# Altium project BRG_Chip_Tester.PrjPcb
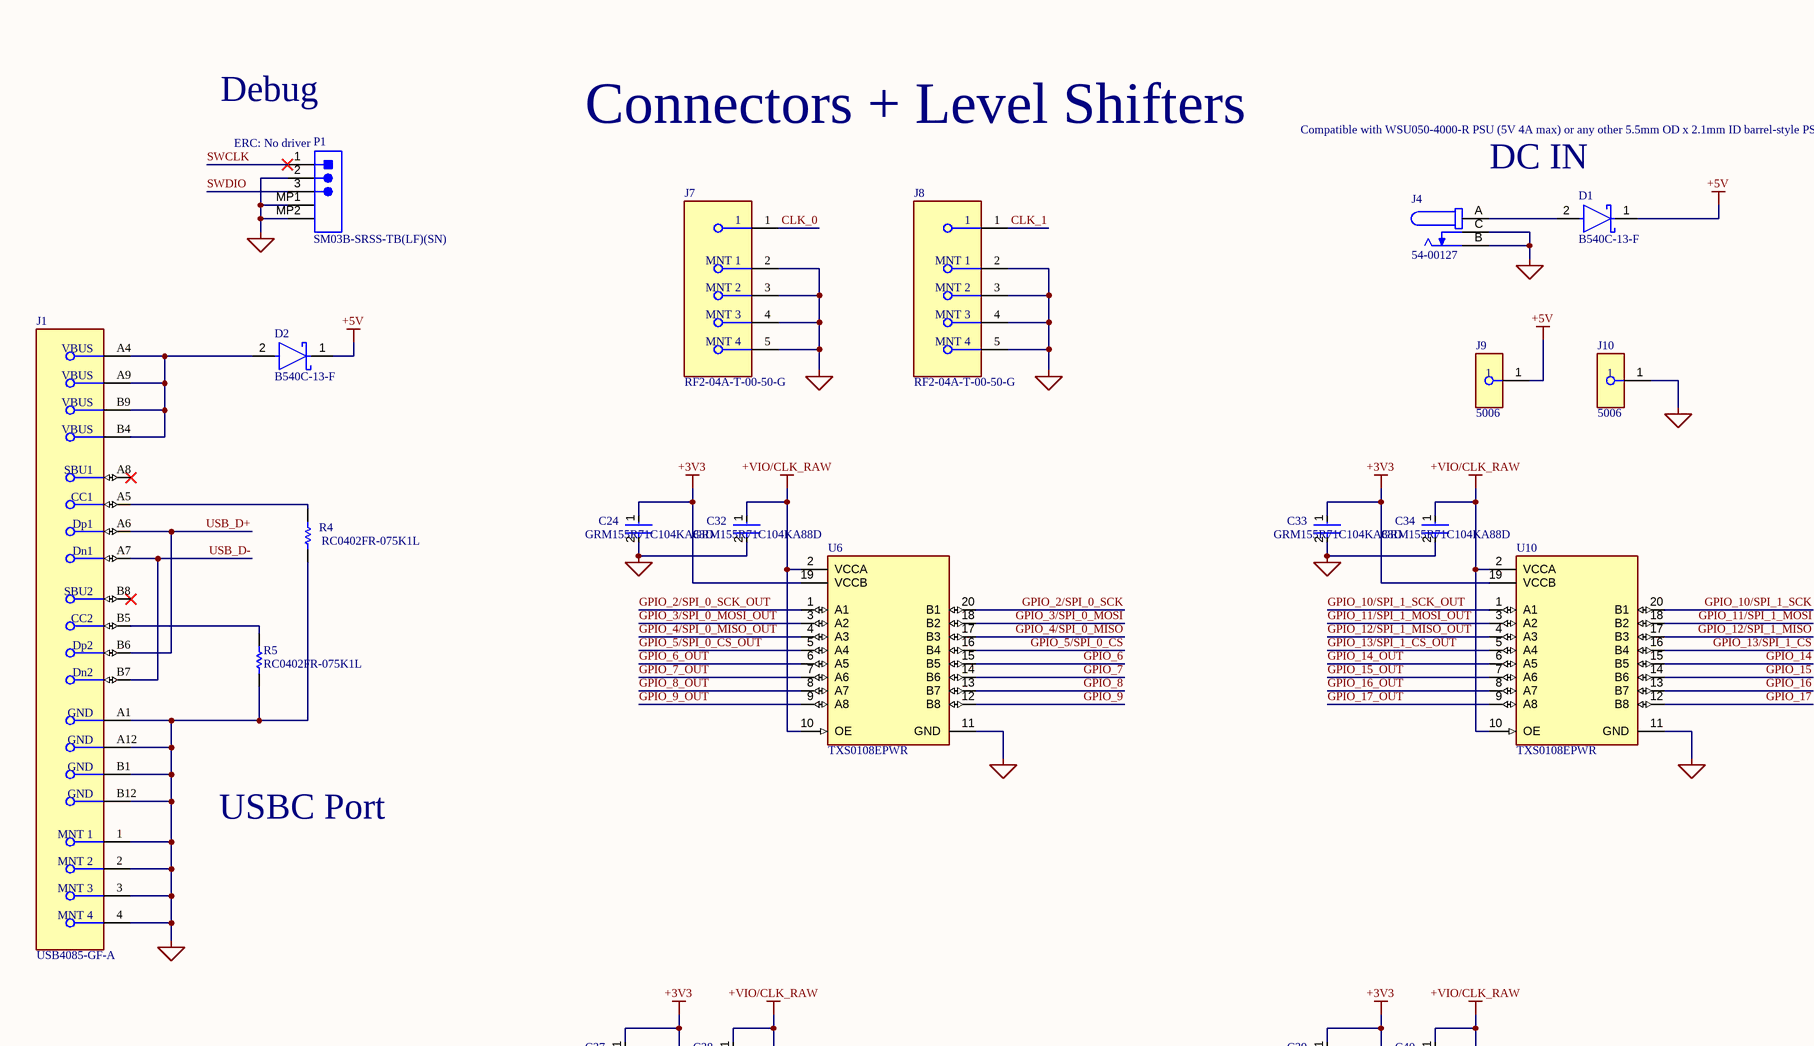
[diagram p0: BRG_Chip_Tester.SchDoc, top left]
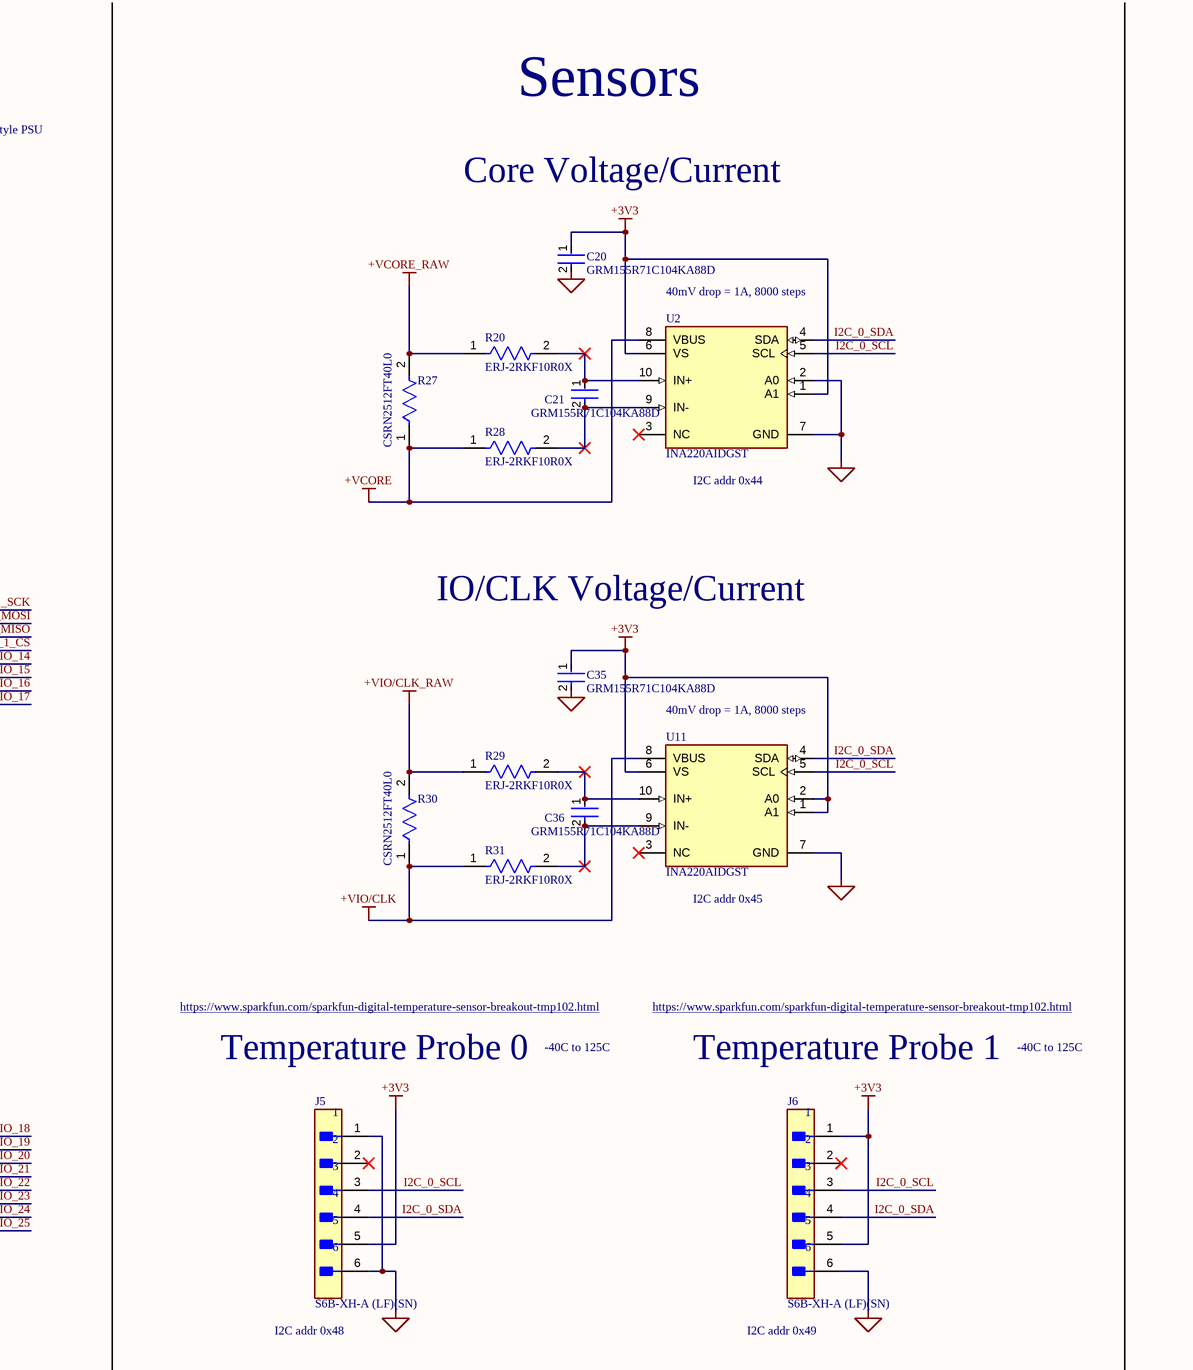
[diagram p1: BRG_Chip_Tester.SchDoc, top middle]
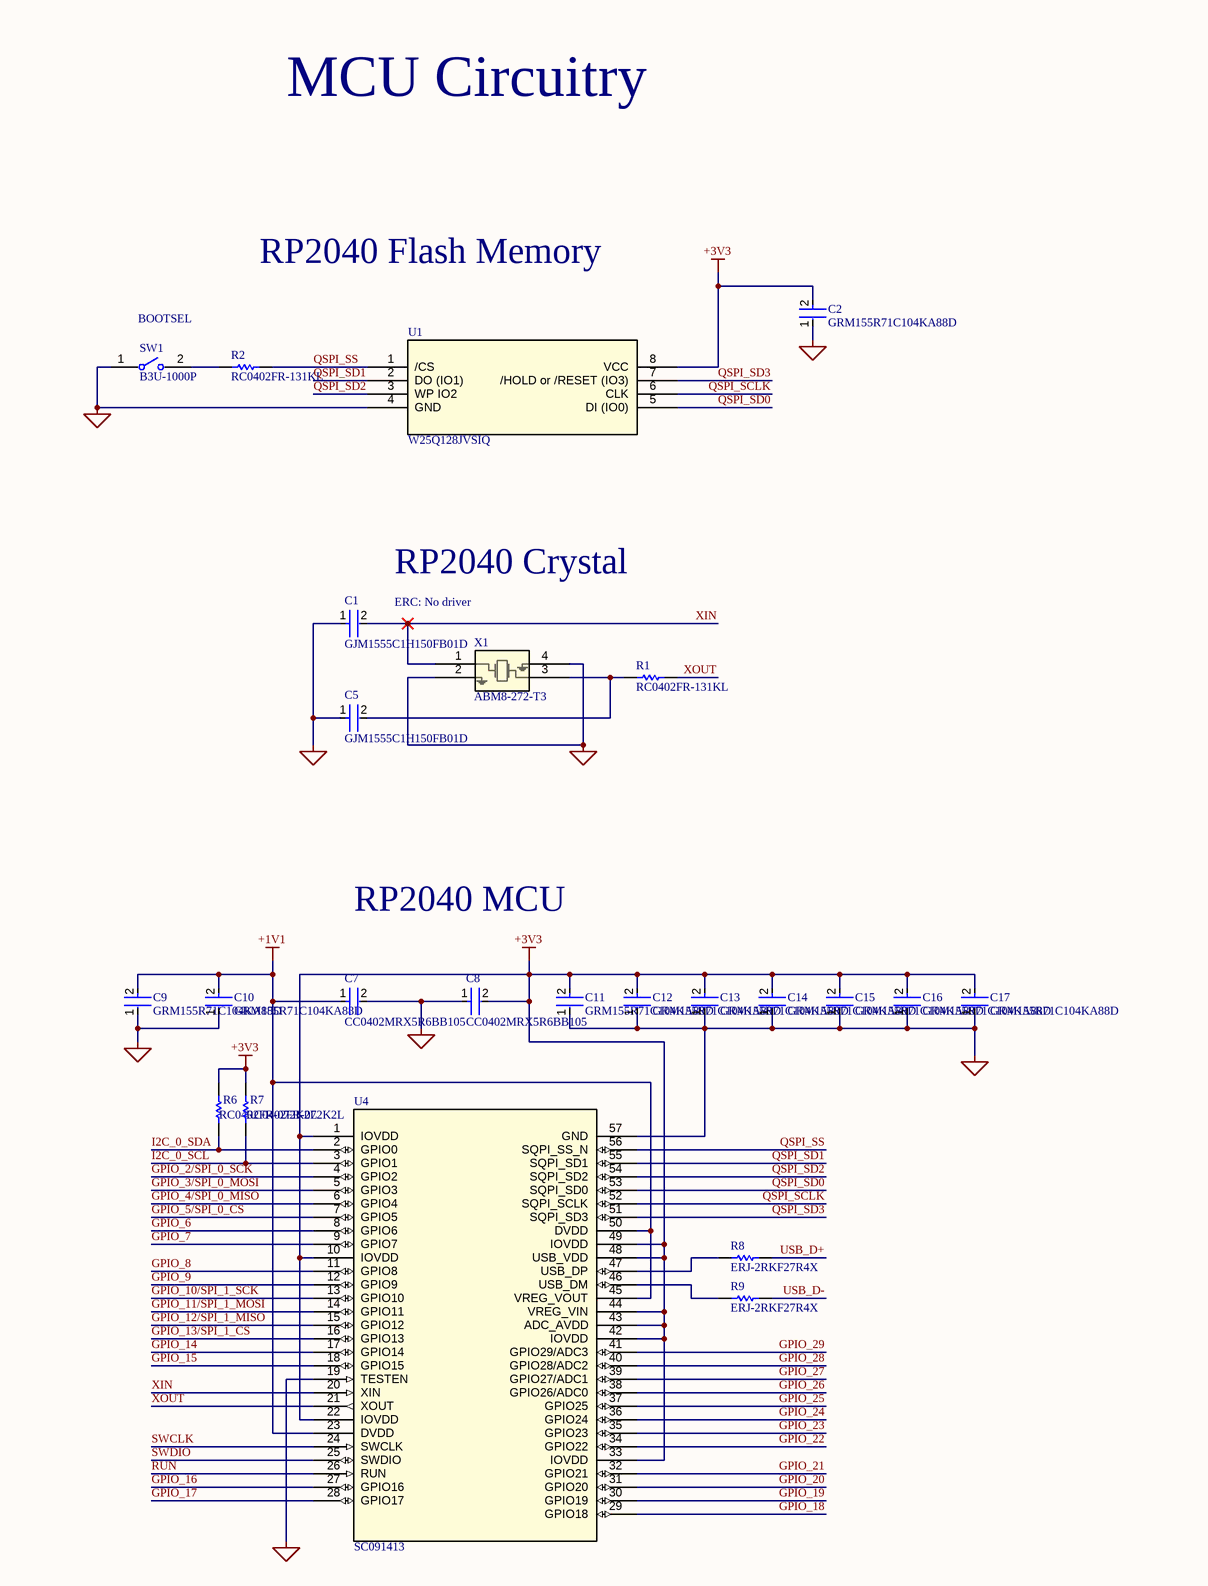
[diagram p2: BRG_Chip_Tester.SchDoc, top right]
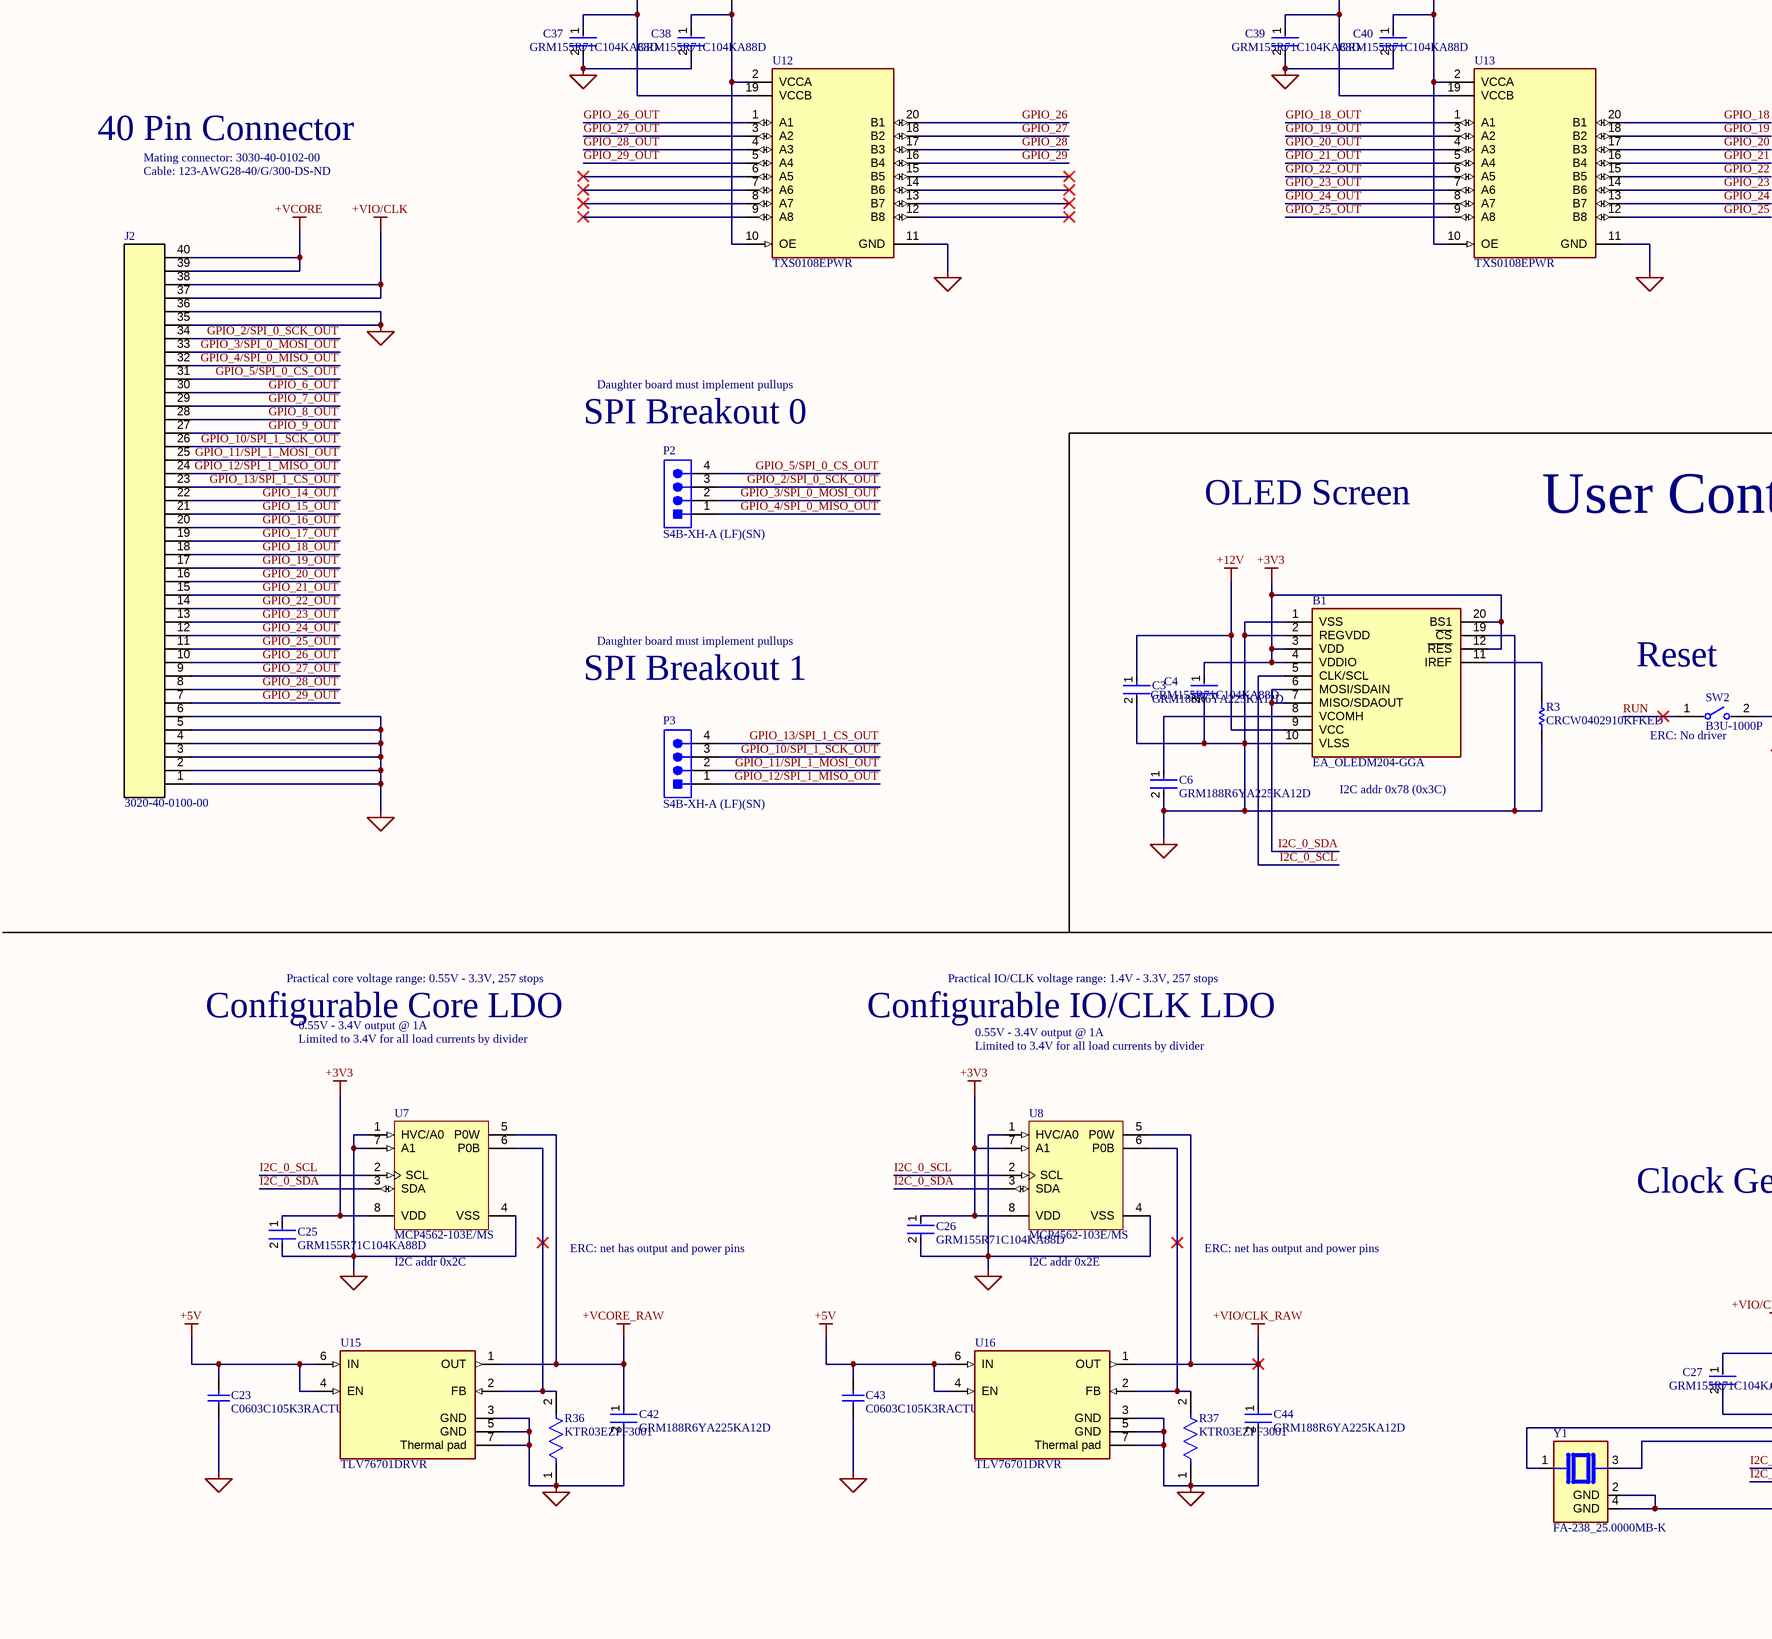
[diagram p3: BRG_Chip_Tester.SchDoc, bottom left]
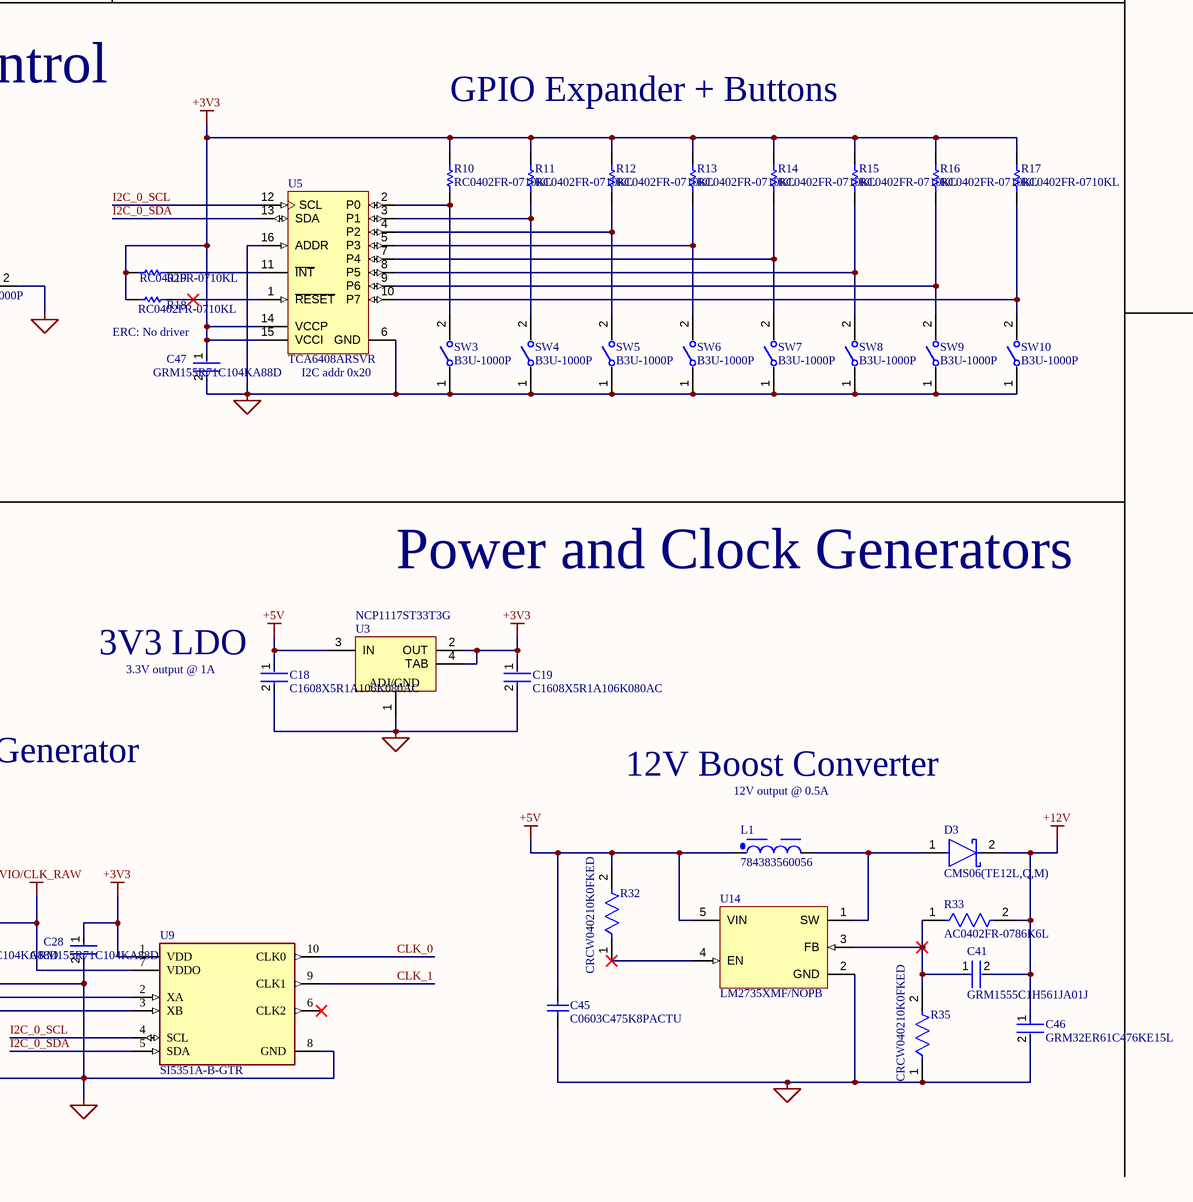
[diagram p4: BRG_Chip_Tester.SchDoc, bottom middle]
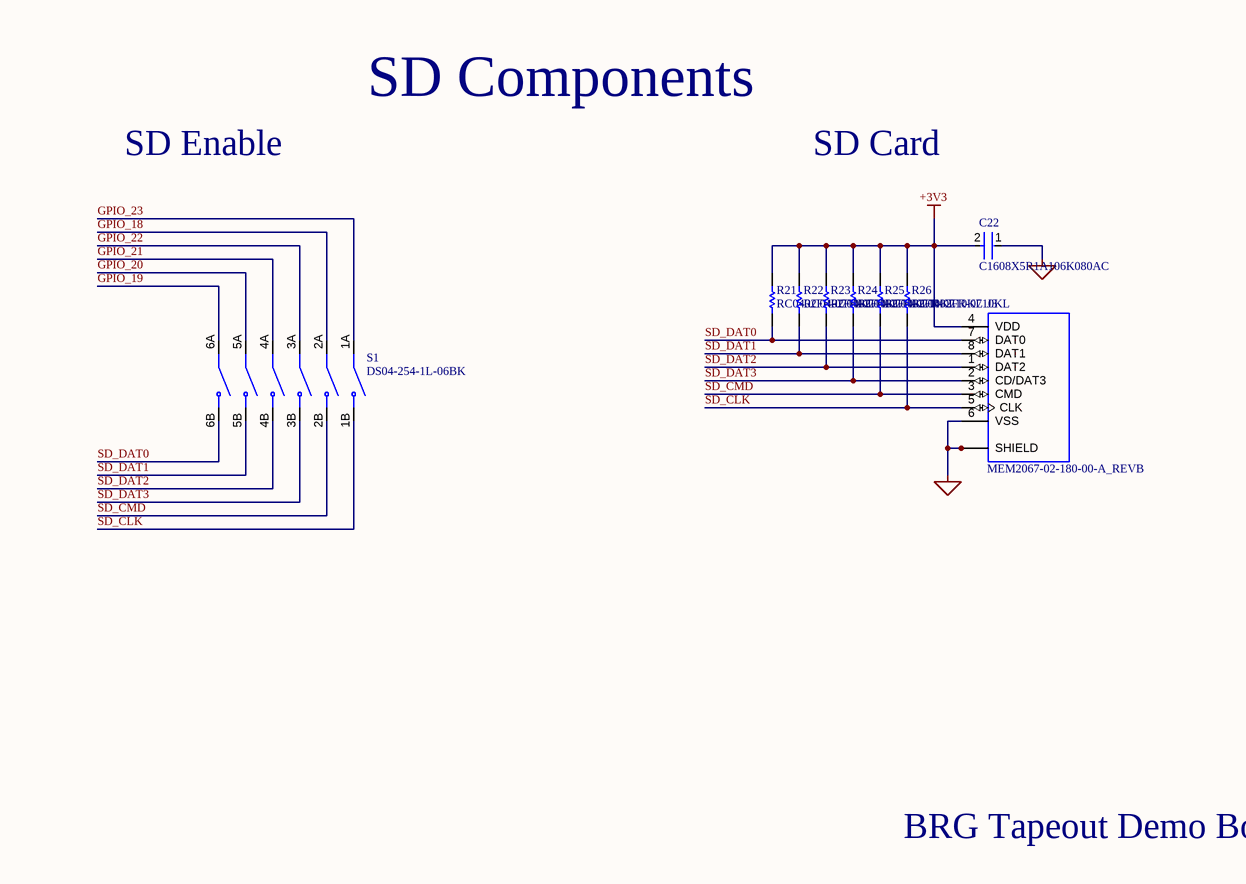
[diagram p5: BRG_Chip_Tester.SchDoc, bottom right]
1 sheet, 127 parts. Net scope: global (net labels, ports and power ports of the same name join across sheets).
Board file: BRG_Chip_Tester.PcbDoc

## Sheet BRG_Chip_Tester.SchDoc
size 863 x 558 mm; SheetNumber: 1; SheetTotal: 1

### Parts
B1  EA_OLEDM204-GGA  [EAOLEDM204GGA]
C1  GJM1555C1H150FB01D  [FP-GJM155-0_05-MFG]
C2  GRM155R71C104KA88D  [FP-GRM15-MFG]
C3  GRM188R6YA225KA12D  [FP-GRM188-0_1-e0_2_0_5-IPC_C]
C4  GRM155R71C104KA88D  [FP-GRM15-MFG]
C5  GJM1555C1H150FB01D  [FP-GJM155-0_05-MFG]
C6  GRM188R6YA225KA12D  [FP-GRM188-0_1-e0_2_0_5-IPC_C]
C7  CC0402MRX5R6BB105  [FP-CC0402-MFG]
C8  CC0402MRX5R6BB105  [FP-CC0402-MFG]
C9  GRM155R71C104KA88D  [FP-GRM15-MFG]
C10  GRM155R71C104KA88D  [FP-GRM15-MFG]
C11  GRM155R71C104KA88D  [FP-GRM15-MFG]
C12  GRM155R71C104KA88D  [FP-GRM15-MFG]
C13  GRM155R71C104KA88D  [FP-GRM15-MFG]
C14  GRM155R71C104KA88D  [FP-GRM15-MFG]
C15  GRM155R71C104KA88D  [FP-GRM15-MFG]
C16  GRM155R71C104KA88D  [FP-GRM15-MFG]
C17  GRM155R71C104KA88D  [FP-GRM15-MFG]
C18  C1608X5R1A106K080AC  [FP-C1608-080-0_1-MFG]
C19  C1608X5R1A106K080AC  [FP-C1608-080-0_1-MFG]
C20  GRM155R71C104KA88D  [FP-GRM15-MFG]
C21  GRM155R71C104KA88D  [FP-GRM15-MFG]
C22  C1608X5R1A106K080AC  [FP-C1608-080-0_1-MFG]
C23  C0603C105K3RACTU  [CAPC1608X87X35LL15T15]
C24  GRM155R71C104KA88D  [FP-GRM15-MFG]
C25  GRM155R71C104KA88D  [FP-GRM15-MFG]
C26  GRM155R71C104KA88D  [FP-GRM15-MFG]
C27  GRM155R71C104KA88D  [FP-GRM15-MFG]
C28  GRM155R71C104KA88D  [FP-GRM15-MFG]
C32  GRM155R71C104KA88D  [FP-GRM15-MFG]
C33  GRM155R71C104KA88D  [FP-GRM15-MFG]
C34  GRM155R71C104KA88D  [FP-GRM15-MFG]
C35  GRM155R71C104KA88D  [FP-GRM15-MFG]
C36  GRM155R71C104KA88D  [FP-GRM15-MFG]
C37  GRM155R71C104KA88D  [FP-GRM15-MFG]
C38  GRM155R71C104KA88D  [FP-GRM15-MFG]
C39  GRM155R71C104KA88D  [FP-GRM15-MFG]
C40  GRM155R71C104KA88D  [FP-GRM15-MFG]
C41  GRM1555C1H561JA01J  [FP-GRM155-0_05-IPC_A]
C42  GRM188R6YA225KA12D  [FP-GRM188-0_1-e0_2_0_5-IPC_C]
C43  C0603C105K3RACTU  [CAPC1608X87X35LL15T15]
C44  GRM188R6YA225KA12D  [FP-GRM188-0_1-e0_2_0_5-IPC_C]
C45  C0603C475K8PACTU  [CAPC1608X87X35NL15T15]
C46  GRM32ER61C476KE15L  [FP-GRM32E-0_3-0_2-IPC_C]
C47  GRM155R71C104KA88D  [FP-GRM15-MFG]
D1  B540C-13-F  [FP-SMC-MFG]
D2  B540C-13-F  [FP-SMC-MFG]
D3  CMS06(TE12L,Q,M)  [FP-M-FLAT-MFG]
J1  USB4085-GF-A  [FP-USB4085-GF-A-MFG]
J2  3020-40-0100-00  [CONN_3020-40-0100-00_CNC]
J3  MEM2067-02-180-00-A_REVB  [GCT_MEM2067-02-180-00-A_REVB]
J4  54-00127  [TENSILITY_54-00127]
J5  S6B-XH-A (LF)(SN)  [FP-S6B-XH-A_LF_SN-MFG]
J6  S6B-XH-A (LF)(SN)  [FP-S6B-XH-A_LF_SN-MFG]
J7  RF2-04A-T-00-50-G  [FP-RF2-04A-T-00-50-G-MFG]
J8  RF2-04A-T-00-50-G  [FP-RF2-04A-T-00-50-G-MFG]
J9  5006  [FP-5006-MFG]
J10  5006  [FP-5006-MFG]
L1  784383560056  [WE-MAIA_4020]
P1  SM03B-SRSS-TB(LF)(SN)  [JST-SM03B-SRSS-TB_V]
P2  S4B-XH-A (LF)(SN)  [JST-S4B-XH-A(LF)(SN)_V]
P3  S4B-XH-A (LF)(SN)  [JST-S4B-XH-A(LF)(SN)_V]
R1  RC0402FR-131KL  [RESC1005X40X25LL05T10]
R2  RC0402FR-131KL  [RESC1005X40X25LL05T10]
R3  CRCW0402910KFKED  [RESC1005X40X25LL05T05]
R4  RC0402FR-075K1L  [RESC1005X40X25NL05T10]
R5  RC0402FR-075K1L  [RESC1005X40X25NL05T10]
R6  RC0402FR-072K2L  [RESC1005X40X25NL05T10]
R7  RC0402FR-072K2L  [RESC1005X40X25NL05T10]
R8  ERJ-2RKF27R4X  [RESC1005X40X25ML05T05]
R9  ERJ-2RKF27R4X  [RESC1005X40X25ML05T05]
R10  RC0402FR-0710KL  [RESC1005X40X25LL05T10]
R11  RC0402FR-0710KL  [RESC1005X40X25LL05T10]
R12  RC0402FR-0710KL  [RESC1005X40X25LL05T10]
R13  RC0402FR-0710KL  [RESC1005X40X25LL05T10]
R14  RC0402FR-0710KL  [RESC1005X40X25LL05T10]
R15  RC0402FR-0710KL  [RESC1005X40X25LL05T10]
R16  RC0402FR-0710KL  [RESC1005X40X25LL05T10]
R17  RC0402FR-0710KL  [RESC1005X40X25LL05T10]
R18  RC0402FR-0710KL  [RESC1005X40X25LL05T10]
R19  RC0402FR-0710KL  [RESC1005X40X25LL05T10]
R20  ERJ-2RKF10R0X  [FP-ERJ2RK-MFG]
R21  RC0402FR-0710KL  [RESC1005X40X25LL05T10]
R22  RC0402FR-0710KL  [RESC1005X40X25LL05T10]
R23  RC0402FR-0710KL  [RESC1005X40X25LL05T10]
R24  RC0402FR-0710KL  [RESC1005X40X25LL05T10]
R25  RC0402FR-0710KL  [RESC1005X40X25LL05T10]
R26  RC0402FR-0710KL  [RESC1005X40X25LL05T10]
R27  CSRN2512FT40L0  [FP-CSRN2512-IPC_C]
R28  ERJ-2RKF10R0X  [FP-ERJ2RK-MFG]
R29  ERJ-2RKF10R0X  [FP-ERJ2RK-MFG]
R30  CSRN2512FT40L0  [FP-CSRN2512-IPC_C]
R31  ERJ-2RKF10R0X  [FP-ERJ2RK-MFG]
R32  CRCW040210K0FKED  [FP-CRCW0402-e3-IPC_B]
R33  AC0402FR-0786K6L  [FP-AC0402-IPC_B]
R35  CRCW040210K0FKED  [FP-CRCW0402-e3-IPC_B]
R36  KTR03EZPF3001  [FP-KTR03-MFG]
R37  KTR03EZPF3001  [FP-KTR03-MFG]
S1  DS04-254-1L-06BK  [SW_DS04-254-1L-06BK]
SW1  B3U-1000P  [FP-B3U-1000P-MFG]
SW2  B3U-1000P  [FP-B3U-1000P-MFG]
SW3  B3U-1000P  [FP-B3U-1000P-MFG]
SW4  B3U-1000P  [FP-B3U-1000P-MFG]
SW5  B3U-1000P  [FP-B3U-1000P-MFG]
SW6  B3U-1000P  [FP-B3U-1000P-MFG]
SW7  B3U-1000P  [FP-B3U-1000P-MFG]
SW8  B3U-1000P  [FP-B3U-1000P-MFG]
SW9  B3U-1000P  [FP-B3U-1000P-MFG]
SW10  B3U-1000P  [FP-B3U-1000P-MFG]
U1  W25Q128JVSIQ  [SOIC_128JVSIQ_WIN]
U2  INA220AIDGST  [FP-DGS0010A-MFG]
U3  NCP1117ST33T3G  [ONSC-SOT-223-4-318H-01_A_V]
U4  SC091413  [QFN56_7X7_RPI]
U5  TCA6408ARSVR  [RSV0016A_V]
U6  TXS0108EPWR  [FP-PW0020A-IPC_C]
U7  MCP4562-103E/MS  [MSOP-MS8_M]
U8  MCP4562-103E/MS  [MSOP-MS8_M]
U9  SI5351A-B-GTR  [FP-SI5351A-B-GTR-MFG]
U10  TXS0108EPWR  [FP-PW0020A-IPC_C]
U11  INA220AIDGST  [FP-DGS0010A-MFG]
U12  TXS0108EPWR  [FP-PW0020A-IPC_C]
U13  TXS0108EPWR  [FP-PW0020A-IPC_C]
U14  LM2735XMF/NOPB  [DBV0005A_N]
U15  TLV76701DRVR  [FP-DRV0006A-IPC_C]
U16  TLV76701DRVR  [FP-DRV0006A-IPC_C]
X1  ABM8-272-T3  [ABM8-272-T3_ABR]
Y1  FA-238_25.0000MB-K  [XTAL_FA-238_25.0000MB-K]

### Nets
+1V1: C7.1 C9.2 C10.2 U4.23(DVDD) U4.45(VREG_VOUT) U4.50(DVDD)
+3V3: B1.3(VDD) B1.4(VDDIO) B1.12(~{RES}) B1.20(BS1) C2.2 C4.1 C8.2 C11.2 C12.2 C13.2 C14.2 C15.2 C16.2 C17.2 C19.1 C20.1 C22.2 C24.1 C25.1 C26.1 C28.1 C33.1 C35.1 C37.1 C39.1 C47.1 J3.4(VDD) J5.5 J6.1 J6.5 R6.2 R7.2 R10.2 R11.2 R12.2 R13.2 R14.2 R15.2 R16.2 R17.2 R18.1 R19.2 R21.2 R22.2 R23.2 R24.2 R25.2 R26.2 U1.8(VCC) U2.1(A1) U2.6(VS) U3.2(OUT) U3.4(TAB) U4.1(IOVDD) U4.10(IOVDD) U4.22(IOVDD) U4.33(IOVDD) U4.42(IOVDD) U4.43(ADC_AVDD) U4.44(VREG_VIN) U4.48(USB_VDD) U4.49(IOVDD) U5.14(VCCP) U5.15(VCCI) U6.19(VCCB) U7.8(VDD) U8.7(A1) U8.8(VDD) U9.1(VDD) U10.19(VCCB) U11.1(A1) U11.2(A0) U11.6(VS) U12.19(VCCB) U13.19(VCCB)
+5V: C18.1 C23.2 C43.2 C45.2 D1.1(C) D2.1(C) J9.1 L1.1 R32.2 U3.3(IN) U14.5(VIN) U15.4(EN) U15.6(IN) U16.4(EN) U16.6(IN)
+12V: B1.9(VCC) C3.1 C41.2 C46.1 D3.2(C) R33.2
+VCORE: J2.39 J2.40 R27.1 R28.1 U2.8(VBUS)
+VCORE_RAW: C42.1 R20.1 R27.2 U7.5(P0W) U15.1(OUT)
+VIO/CLK: J2.37 J2.38 R30.1 R31.1 U11.8(VBUS)
+VIO/CLK_RAW: C27.1 C32.1 C34.1 C38.1 C40.1 C44.1 R29.1 R30.2 U6.2(VCCA) U6.10(OE) U8.5(P0W) U9.7(VDDO) U10.2(VCCA) U10.10(OE) U12.2(VCCA) U12.10(OE) U13.2(VCCA) U13.10(OE) U16.1(OUT)
GND: B1.1(VSS) B1.2(REGVDD) B1.10(VLSS) B1.19(~{CS}) C1.1 C2.1 C3.2 C4.2 C5.1 C6.2 C7.2 C8.1 C9.1 C10.1 C11.1 C12.1 C13.1 C14.1 C15.1 C16.1 C17.1 C18.2 C19.2 C20.2 C22.1 C23.1 C24.2 C25.2 C26.2 C27.2 C28.2 C32.2 C33.2 C34.2 C35.2 C37.2 C38.2 C39.2 C40.2 C42.2 C43.1 C44.2 C45.1 C46.2 C47.2 J1.1(MNT_1) J1.2(MNT_2) J1.3(MNT_3) J1.4(MNT_4) J1.A1(GND) J1.A12(GND) J1.B1(GND) J1.B12(GND) J2.1 J2.2 J2.3 J2.4 J2.5 J2.6 J2.35 J2.36 J3.6(VSS) J3.9(SHIELD) J3.10(SHIELD) J3.11(SHIELD) J3.12(SHIELD) J4.B J4.C J5.1 J5.6 J6.6 J7.2(MNT_1) J7.3(MNT_2) J7.4(MNT_3) J7.5(MNT_4) J8.2(MNT_1) J8.3(MNT_2) J8.4(MNT_3) J8.5(MNT_4) J10.1 P1.2 P1.MP1 P1.MP2 R3.1 R4.1 R5.1 R35.1 R36.1 R37.1 SW1.1 SW2.2 SW3.1 SW4.1 SW5.1 SW6.1 SW7.1 SW8.1 SW9.1 SW10.1 U1.4(GND) U2.2(A0) U2.7(GND) U3.1(ADJ/GND) U4.19(TESTEN) U4.57(GND) U5.6(GND) U5.16(ADDR) U6.11(GND) U7.1(HVC/A0) U7.4(VSS) U7.7(A1) U8.1(HVC/A0) U8.4(VSS) U9.8(GND) U10.11(GND) U11.7(GND) U12.11(GND) U13.11(GND) U14.2(GND) U15.3(GND) U15.5(GND) U15.7(Thermal_pad) U16.3(GND) U16.5(GND) U16.7(Thermal_pad) X1.2 X1.4 Y1.2(GND) Y1.4(GND)
CLK_0: J7.1 U9.10(CLK0)
CLK_1: J8.1 U9.9(CLK1)
GPIO_2/SPI_0_SCK: U4.4(GPIO2) U6.20(B1)
GPIO_2/SPI_0_SCK_OUT: J2.34 P2.3 U6.1(A1)
GPIO_3/SPI_0_MOSI: U4.5(GPIO3) U6.18(B2)
GPIO_3/SPI_0_MOSI_OUT: J2.33 P2.2 U6.3(A2)
GPIO_4/SPI_0_MISO: U4.6(GPIO4) U6.17(B3)
GPIO_4/SPI_0_MISO_OUT: J2.32 P2.1 U6.4(A3)
GPIO_5/SPI_0_CS: U4.7(GPIO5) U6.16(B4)
GPIO_5/SPI_0_CS_OUT: J2.31 P2.4 U6.5(A4)
GPIO_6: U4.8(GPIO6) U6.15(B5)
GPIO_6_OUT: J2.30 U6.6(A5)
GPIO_7: U4.9(GPIO7) U6.14(B6)
GPIO_7_OUT: J2.29 U6.7(A6)
GPIO_8: U4.11(GPIO8) U6.13(B7)
GPIO_8_OUT: J2.28 U6.8(A7)
GPIO_9: U4.12(GPIO9) U6.12(B8)
GPIO_9_OUT: J2.27 U6.9(A8)
GPIO_10/SPI_1_SCK: U4.13(GPIO10) U10.20(B1)
GPIO_10/SPI_1_SCK_OUT: J2.26 P3.3 U10.1(A1)
GPIO_11/SPI_1_MOSI: U4.14(GPIO11) U10.18(B2)
GPIO_11/SPI_1_MOSI_OUT: J2.25 P3.2 U10.3(A2)
GPIO_12/SPI_1_MISO: U4.15(GPIO12) U10.17(B3)
GPIO_12/SPI_1_MISO_OUT: J2.24 P3.1 U10.4(A3)
GPIO_13/SPI_1_CS: U4.16(GPIO13) U10.16(B4)
GPIO_13/SPI_1_CS_OUT: J2.23 P3.4 U10.5(A4)
GPIO_14: U4.17(GPIO14) U10.15(B5)
GPIO_14_OUT: J2.22 U10.6(A5)
GPIO_15: U4.18(GPIO15) U10.14(B6)
GPIO_15_OUT: J2.21 U10.7(A6)
GPIO_16: U4.27(GPIO16) U10.13(B7)
GPIO_16_OUT: J2.20 U10.8(A7)
GPIO_17: U4.28(GPIO17) U10.12(B8)
GPIO_17_OUT: J2.19 U10.9(A8)
GPIO_18: S1.2A(COM2) U4.29(GPIO18) U13.20(B1)
GPIO_18_OUT: J2.18 U13.1(A1)
GPIO_19: S1.6A(COM6) U4.30(GPIO19) U13.18(B2)
GPIO_19_OUT: J2.17 U13.3(A2)
GPIO_20: S1.5A(COM5) U4.31(GPIO20) U13.17(B3)
GPIO_20_OUT: J2.16 U13.4(A3)
GPIO_21: S1.4A(COM4) U4.32(GPIO21) U13.16(B4)
GPIO_21_OUT: J2.15 U13.5(A4)
GPIO_22: S1.3A(COM3) U4.34(GPIO22) U13.15(B5)
GPIO_22_OUT: J2.14 U13.6(A5)
GPIO_23: S1.1A(COM1) U4.35(GPIO23) U13.14(B6)
GPIO_23_OUT: J2.13 U13.7(A6)
GPIO_24: U4.36(GPIO24) U13.13(B7)
GPIO_24_OUT: J2.12 U13.8(A7)
GPIO_25: U4.37(GPIO25) U13.12(B8)
GPIO_25_OUT: J2.11 U13.9(A8)
GPIO_26: U4.38(GPIO26/ADC0) U12.20(B1)
GPIO_26_OUT: J2.10 U12.1(A1)
GPIO_27: U4.39(GPIO27/ADC1) U12.18(B2)
GPIO_27_OUT: J2.9 U12.3(A2)
GPIO_28: U4.40(GPIO28/ADC2) U12.17(B3)
GPIO_28_OUT: J2.8 U12.4(A3)
GPIO_29: U4.41(GPIO29/ADC3) U12.16(B4)
GPIO_29_OUT: J2.7 U12.5(A4)
I2C_0_SCL: B1.5(CLK/SCL) J5.3 J6.3 R7.1 U2.5(SCL) U4.3(GPIO1) U5.12(SCL) U7.2(SCL) U8.2(SCL) U9.4(SCL) U11.5(SCL)
I2C_0_SDA: B1.6(MOSI/SDAIN) B1.7(MISO/SDAOUT) J5.4 J6.4 R6.1 U2.4(SDA) U4.2(GPIO0) U5.13(SDA) U7.3(SDA) U8.3(SDA) U9.5(SDA) U11.4(SDA)
QSPI_SCLK: U1.6(CLK) U4.52(SQPI_SCLK)
QSPI_SD0: U1.5(DI_(IO0)) U4.53(SQPI_SD0)
QSPI_SD1: U1.2(DO_(IO1)) U4.55(SQPI_SD1)
QSPI_SD2: U1.3(WP_IO2) U4.54(SQPI_SD2)
QSPI_SD3: U1.7(/HOLD_or_/RESET_(IO3)) U4.51(SQPI_SD3)
QSPI_SS: R2.2 U1.1(/CS) U4.56(SQPI_SS_N)
RUN: SW2.1 U4.26(RUN)
SD_CLK: J3.5(CLK) R26.1 S1.1B(NO1)
SD_CMD: J3.3(CMD) R25.1 S1.2B(NO2)
SD_DAT0: J3.7(DAT0) R21.1 S1.6B(NO6)
SD_DAT1: J3.8(DAT1) R22.1 S1.5B(NO5)
SD_DAT2: J3.1(DAT2) R23.1 S1.4B(NO4)
SD_DAT3: J3.2(CD/DAT3) R24.1 S1.3B(NO3)
SWCLK: P1.1 U4.24(SWCLK)
SWDIO: P1.3 U4.25(SWDIO)
USB_D+: J1.A6(Dp1) J1.B6(Dp2) R8.2
USB_D-: J1.A7(Dn1) J1.B7(Dn2) R9.2
XIN: C1.2 U4.20(XIN) X1.1
XOUT: R1.2 U4.21(XOUT)
NetB1_8: B1.8(VCOMH) C6.1
NetB1_11: B1.11(IREF) R3.2
NetC5_2: C5.2 R1.1 X1.3
NetC21_1: C21.1 R20.2 U2.10(IN+)
NetC21_2: C21.2 R28.2 U2.9(IN-)
NetC36_1: C36.1 R29.2 U11.10(IN+)
NetC36_2: C36.2 R31.2 U11.9(IN-)
NetC41_1: C41.1 R33.1 R35.2 U14.3(FB)
NetD1_2: D1.2(A) J4.A
NetD2_2: D2.2(A) J1.A4(VBUS) J1.A9(VBUS) J1.B4(VBUS) J1.B9(VBUS)
NetD3_1: D3.1(A) L1.2 U14.1(SW)
NetJ1_A5: J1.A5(CC1) R4.2
NetJ1_B5: J1.B5(CC2) R5.2
NetR2_1: R2.1 SW1.2
NetR8_1: R8.1 U4.47(USB_DP)
NetR9_1: R9.1 U4.46(USB_DM)
NetR10_1: R10.1 SW3.2 U5.2(P0)
NetR11_1: R11.1 SW4.2 U5.3(P1)
NetR12_1: R12.1 SW5.2 U5.4(P2)
NetR13_1: R13.1 SW6.2 U5.5(P3)
NetR14_1: R14.1 SW7.2 U5.7(P4)
NetR15_1: R15.1 SW8.2 U5.8(P5)
NetR16_1: R16.1 SW9.2 U5.9(P6)
NetR17_1: R17.1 SW10.2 U5.10(P7)
NetR18_2: R18.2 U5.1(~{RESET})
NetR19_1: R19.1 U5.11(~{INT})
NetR32_1: R32.1 U14.4(EN)
NetR36_2: R36.2 U7.6(P0B) U15.2(FB)
NetR37_2: R37.2 U8.6(P0B) U16.2(FB)
NetU9_2: U9.2(XA) Y1.1
NetU9_3: U9.3(XB) Y1.3

Not connected (* = marked no-connect by the designer): J1 A8(SBU1)* B8(SBU2)*; J5 2*; J6 2*; U2 3(NC)*; U9 6(CLK2)*; U11 3(NC)*; U12 6(A5)* 7(A6)* 8(A7)* 9(A8)* 12(B8)* 13(B7)* 14(B6)* 15(B5)*

### Notes on the sheet
- Debug
- (near P1) ERC: No driver
- Connectors + Level Shifters
- Compatible with WSU050-4000-R PSU (5V 4A max) or any other 5.5mm OD x 2.1mm ID barrel-style PSU
- Sensors
- DC IN
- Core Voltage/Current
- MCU Circuitry
- (near U2) 40mV drop = 1A, 8000 steps
- RP2040 Flash Memory
- (near SW1) BOOTSEL
- (near U2) I2C addr 0x44
- IO/CLK Voltage/Current
- RP2040 Crystal
- ERC: No driver
- (near U11) 40mV drop = 1A, 8000 steps
- USBC Port
- (near U11) I2C addr 0x45
- https://www.sparkfun.com/sparkfun-digital-temperature-sensor-breakout-tmp102.html
- RP2040 MCU
- Temperature Probe 0
- -40C to 125C
- Temperature Probe 1
- 40 Pin Connector
- Mating connector: 3030-40-0102-00
- Cable: 123-AWG28-40/G/300-DS-ND
- I2C addr 0x48
- I2C addr 0x49
- Daughter board must implement pullups
- (near P2) SPI Breakout 0
- OLED Screen
- User Control
- GPIO Expander + Buttons
- SPI Breakout 1
- (near SW2) Reset
- (near SW2) ERC: No driver
- (near B1) I2C addr 0x78 (0x3C)
- (near U5) I2C addr 0x20
- SD Components
- SD Enable
- SD Card
- Configurable Core LDO
- Practical core voltage range: 0.55V - 3.3V, 257 stops
- Configurable IO/CLK LDO
- Practical IO/CLK voltage range: 1.4V - 3.3V, 257 stops
- Power and Clock Generators
- 0.55V - 3.4V output @ 1A
- Limited to 3.4V for all load currents by divider
- (near C18) 3V3 LDO
- (near C18) 3.3V output @ 1A
- Clock Generator
- 12V Boost Converter
- 12V output @ 0.5A
- (near U7) I2C addr 0x2C
- ERC: net has output and power pins
- (near U8) I2C addr 0x2E
- BRG Tapeout Demo Board
- DWG. NO.
- REV.
- SHT.
- REVISION
- DESCRIPTION
- DATE
- APPROVED
- THIS DOCUMENT AND THE DATA DISCLOSED HEREIN OR HEREWITH IS THE PROPERTY OF ALTIUM LIMITED AND MAY BE FREELY DISTRIBUTED IN WHOLE. NO RIGHTS ARE RESERVED OR EXPRESS OR IMPLIED WARANTEE GIVEN.
- ENG:
- DSN:
- APPROVALS
- PROJECT
- DOCUMENT REVISION:
- DESIGN ITEM:
- CHK:
- BOM:
- REFERENCE DOCUMENTS
- PROJECT REVISION:
- TITLE
- FAB DWG:
- PCB DWG:
- ASSY DWG:
- SCALE:
- SIZE
- D
- CAGE CODE
- FILE NAME
- DWG NO.
- SHEET
- OF
- REV

### Library data of the parts
B1 = EA_OLEDM204-GGA: OLED Displays & Accessories Charcter OLED Yellow 4x20 with glass; Manufacturer_Name: Display Visions; Manufacturer_Part_Number: EA OLEDM204-GGA; Geometry.Height: 2.4mm; Mouser Part Number: 790-EAOLEDM204GGA; Mouser Price/Stock: https://www.mouser.co.uk/ProductDetail/Display-Visions/EA-OLEDM204-GGA?qs=w%2Fv1CP2dgqpjPd2NeKBlNQ%3D%3D; Datasheet Link: https://www.lcd-module.de/fileadmin/html-seiten/eng/pdf/doma/oledm204-ae.pdf
C1 C5 = CMP-2008-03802-2: Multi-Layer Ceramic Capacitor 15pF C0G  ±1% 0402 Paper T/R; Voltage: 50V; Termination: SMD/SMT; Radiation Hardening: No; Depth: 0.5mm; Length: 1mm; Package Quantity: 10000; Tolerance: 1%; Dielectric: C0G; Capacitance: 15pF; Max Operating Temperature: 125°C; Thickness: 0.022inch; Case Code (Metric): 1005; Min Operating Temperature: -55°C; Case Code (Imperial): 0402; Case/Package: 0402; Voltage Rating (DC): 50V; Height: 0.5mm; Voltage Rating: 50V; Width: 0.02inch; Packaging: Tape and Reel; Mount: Surface Mount
C2 C4 C9-C17 C20 C21 C24-C28 C32-C40 C47 = CMP-2100-03641-2: CAP CER 0.1UF 16V X7R 0402; Standoff Height: 0mm; Tolerance: 10%; RoHS: TRUE; Manufacturer Part Number: GRM155R71C104KA88D; Temperature Characteristic: X7R; Octopart: https://octopart.com/grm155r71c104ka88d-murata-196880; Digikey Description: CAP CER 0.1UF 16V X7R 0402; Device Class L3: Ceramic Capacitors; Height: 0.55mm; ComponentLink2Description: Datasheet; Temperature Range Low: -55°C; Ipc Land Pattern Name: CAPC10050X219; ComponentLink2URL: https://search.murata.co.jp/Ceramy/image/img/A01X/G101/ENG/GRM155R71H471KA01-01A.pdf; Device Class L1: Passive Components; Lead Free: yes; Category: Cap
C3 C6 C42 C44 = CMP-2006-02548-2: Chip Multilayer Ceramic Capacitors for General Purpose, 0603, 2.2uF, X5R, 15%, 10%, 35V; REACH SVHC: No SVHC; Weight: 0.000222oz; Thickness: 0.035inch; Height: 0.8mm; Voltage Rating: 35V; Lead Free: Lead Free; Mount: Surface Mount; Material: Ceramic; Package Quantity: 4000; Capacitance: 2.2uF; Length: 1.6mm; Packaging: Tape and Reel; Case/Package: 0603; Min Operating Temperature: -55°C; Case Code (Metric): 1608; Voltage: 35V; Tolerance: 10%; Max Operating Temperature: 85°C; Depth: 0.8mm; Width: 0.8mm; Case Code (Imperial): 0603; Voltage Rating (DC): 35V; Termination: SMD/SMT; Dielectric: X5R
C7 C8 = CMP-1034-02117-2: CAP CER 1UF 10V X5R 0402; Manufacturer: YAGEO; Material: Ceramic; Tolerance: 0.2; Automotive Grade: NA; Temperature Coefficient: 30ppm/°C; Automotive: No; Category: Cap; ComponentLink2URL: http://www.yageo.com/documents/recent/UPY-GP_NP0_16V-to-50V_16.pdf; Value: 1 uF; Temperature Range High: +125°C; Footprint Url: http://www.yageo.com/exep/pages/download/literatures/UPY-C_GEN_24.pdf; Voltage Rating: 10 V; Height: 0.55mm; RoHS: TRUE; Device Class L2: Capacitors; Capacitance: 1 uF; Device Class L1: Passive Components; Device Class L3: Ceramic Capacitors; Temperature Characteristic: X5R; Temperature Range Low: -55°C; Mouser Description: Multilayer Ceramic Capacitors MLCC - SMD/SMT 1.0uF 10V X5R 20%; Octopart: https://octopart.com/cc0402mrx5r6bb105-yageo-9292740; ComponentLink2Description: Datasheet; Manufacturer Part Number: CC0402MRX5R6BB105; Temperature: -55°C to +125°C; Lead Free: Yes; Digikey Description: CAP CER 1UF 10V X5R 0402; Ipc Land Pattern Name: CAPC10050X50; Package: CC0402
C18 C19 C22 = CMP-2000-04979-3: Multilayer Ceramic Capacitors 10μF ±10% 10V X5R SMD 0603; Capacitance: 10uF; Dielectric Material: Ceramic; Construction: Flat; Height: 0.8mm; Thickness: 0.035inch; Case Code (Metric): 1608; Radiation Hardening: No; Number of Pins: 2; Voltage Rating (DC): 10V; Depth: 0.8mm; Voltage: 10V; RoHS Compliant: Yes; Voltage Rating: 10V; Package Quantity: 1; Resistor Type: Ceramic; Termination: SMD/SMT; Lead Free: Lead Free; REACH SVHC: No SVHC; Tolerance: 10%; Mount: Surface Mount; Series: C; Packaging: Tape and Reel; Width: 0.8mm; Dielectric: X5R; Weight: 7.1E-05oz; Length: 1.6mm; Max Operating Temperature: 85°C; Case Code (Imperial): 0603; Case/Package: 0603; Min Operating Temperature: -55°C
C23 C43 = CMP-2006-03713-1: Manufacturer: Kemet; Part Number: C0603C105K3RACTU
C41 = CMP-2008-04389-2: Chip Multilayer Ceramic Capacitors for General Purpose, 0402, 560pF, C0G, 30ppm/°C, 5%, 50V; Package Quantity: 50000; Mount: Surface Mount; Voltage Rating (DC): 50V; Radiation Hardening: No; Height: 0.5mm; Length: 1mm; Packaging: Tape and Reel; Termination: SMD/SMT; Width: 0.02inch; Case Code (Imperial): 0402; Dielectric: C0G; Capacitance: 560pF; Max Operating Temperature: 125°C; Tolerance: 5%; Thickness: 0.022inch; Case Code (Metric): 1005
C45 = CMP-2006-03238-1: Manufacturer: Kemet; Part Number: C0603C475K8PACTU
C46 = CMP-2000-06362-2: CAP CER 47UF 16V X5R 1210; Tolerance: 10%; Case Code (Metric): 3225; RoHS Compliant: Yes; Min Operating Temperature: -55°C; Radiation Hardening: No; Voltage: 16V; Package Quantity: 1; Case Code (Imperial): 1210; REACH SVHC: No SVHC; Capacitance: 47uF; Voltage Rating (DC): 16V; Dielectric: X5R; Case/Package: 1210; Length: 3.2mm; Voltage Rating: 16V; Packaging: Cut Tape
D1 D2 = CMP-2000-05097-3: DIODE SCHOTTKY 40V 5A SMC; Automotive Grade: NA; Peak Reverse Current: 0.5mA; Value: 300pF; Digikey Description: DIODE SCHOTTKY 40V 5A SMC; Temperature Range Low: -55°C; Manufacturer Part Number: B540C-13-F; Octopart: https://octopart.com/b540c-13-f-diodes+inc.-325873; Lead Free: Yes; Reverse Voltage: 40V; RoHS: TRUE; Category: Diode; Mouser Description: Diode: Schottky rectifying; SMD; 40V; 5A; SMC; Package: reel, tape; ComponentLink2Description: Datasheet; Temperature Range High: +150°C; Automotive: No; Footprint Url: https://www.diodes.com/assets/Package-Files/SMC.pdf
D3 = CMP-2000-06115-2: DIODE SCHOTTKY 30V 2A MFLAT; Forward Voltage: 370mV; Peak Non-Repetitive Surge Current: 40A; Max Reverse Leakage Current: 3mA; Element Configuration: Single; Package Quantity: 1; Max Operating Temperature: 125°C; Mount: Surface Mount; Max Repetitive Reverse Voltage (Vrrm): 30V; Forward Current: 2A; Number of Pins: 2; Min Operating Temperature: -40°C; Radiation Hardening: No; Average Rectified Current: 2A; Contact Plating: Tin; Max Reverse Voltage (DC): 30V; Peak Reverse Current: 3mA
J1 = CMP-196119-000001-2: CONN RCPT USB2.0 TYPE C 24POS RA; Gender: Receptacle; Number of Positions: 16; USB Standard: USB 2.0; Orientation: Right Angle; Contact Plating: Gold; Contact Material: Copper Alloy
J2 = 3020-40-0100-00: No Description Available; Mfr_Name: CNC Tech; RefDes: RefDes; Type: Type
J3 = MEM2067-02-180-00-A_REVB: Micro SD Memory Card ConnectorSMT, Hinged, 1.80mm Profile; Price: None; Value: *; MP: MEM2067-02-180-00-A_REVB; Package: None; Availability: Unavailable
J4 = 54-00127: Connector, dc jack 5.5x2.1 mm, PCB mount, 90 degrees, silver plated, thru hole; MF: Tensility International Corp; Package: None; Price: None; Check_prices: https://www.snapeda.com/parts/54-00127/Tensility+International+Corp/view-part/?ref=eda; Value: *; SnapEDA_Link: https://www.snapeda.com/parts/54-00127/Tensility+International+Corp/view-part/?ref=snap; MP: 54-00127; Availability: In Stock; Purchase-URL: https://pricing.snapeda.com/search?q=54-00127&ref=eda
J5 J6 = CMP-17439-000165-2: CONN HEADER R/A 6POS 2.5MM; Number of Contacts: 6; Contact Resistance: 20mR; Max Current Rating: 3A; Max Voltage Rating (AC): 250V; Fastening Type: Detent; Lead Pitch: 2.5mm; Flammability Rating: UL94 V-0; Contact Finish - Mating: TIN; Housing Material: Polyamide; Length: 17.4mm; Termination: Solder; Contact Type: Male Pin; Number of Positions: 6; Mount: Through Hole; Orientation: Right Angle; Voltage Rating (AC): 250V
J7 J8 = CMP-42753-000002-1: CONN SMA JACK STR 50 OHM PCB
J9 J10 = CMP-19636-000022-1: PC TEST POINT COMPACT BLACK; Body Material: Bronze; Inside Diameter: 1.78mm; Number of Ports: 1; Hole Diameter: 1.6mm; Outside Diameter: 3.18mm; Plating: Silver; Contact Plating: Tin; Color: Black; RoHS Compliant: Yes; Flammability Rating: UL94 V-0; Contact Material: Bronze; Material: Nylon; Orientation: Straight; Package Quantity: 100; Housing Color: Black; Length: 8.89mm; Series: THM; Mount: PCB; Height: 0.35inch; Packaging: Bulk; REACH SVHC: No SVHC; Insulation Material: Nylon; Lead Free: Lead Free
L1 = CMP-03913-81421872-2: 784383560056 Inductor, Aec-Q200, 560Nh, Shld, 8.5A Rohs Compliant: Yes |Wurth Elektronik 784383560056; DC Resistance (DCR): 7mΩ; RoHS: Compliant; Current Rating: 8.5A; Min Operating Temperature: -40°C; Width: 4.1mm; Height: 2.1mm; NexarPartId: 81421872; Inductance: 560nH; Ambient Temperature Range High: 85°C; Max Operating Temperature: 125°C; Length: 4.1mm; Number of Pins: 2; Ambient Temperature Range Low: -40°C
P1 = CMP-2000-07077-1: Male Header, Pitch 1 mm, 1 x 3 Position, Height 2.9 mm, -25 to 85 degC, RoHS, Tape and Reel; Manufacturer: JST; Pitch: 1mm; Style/Orientation: RightAngleHeader/Plug; No of Positions: 3; Package Description: Male Header, Pitch 1 mm, 1 x 3 Position, Height 2.9 mm; Manufacturer URL: http://www.jst.com/home2.html; Package Reference: SM03B-SRSS-TB; Type: ShroudedHeader; Termination: Crimp; Mounting Technology: SurfaceMount; Datasheet Version: 11/2010; Datasheet URL: https://datasheet.ciiva.com/26894/getdatasheetpartid-708885-26894671.pdf
P2 P3 = CMP-2100-03683-1: XH Series Disconnectable Crimp Style Connector, Pitch 2.5 mm, 1 x 4 Position, Height 6.1 mm, Tail Length 3.4 mm, -25 to 85 degC, RoHS, Bulk; PackageReference: S4B-XH-A(LF)(SN); ComponentLink1Description: Manufacturer URL; DatasheetVersion: May-16; ComponentLink2Description: Datasheet; ComponentLink2URL: http://www.jst-mfg.com/product/pdf/eng/eXH.pdf; ComponentLink1URL: http://www.jst.com/home2.html; PackageDescription: Male Header, Pitch 2.5 mm, 1 x 4 Position, Height 6.1 mm, Tail Length 3.4 mm
R1 R2 = CMP-2002-07865-1: Manufacturer: Yageo; Part Number: RC0402FR-131KL
R3 = CMP-2002-00300-1: Manufacturer: Vishay Dale; Part Number: CRCW0402910KFKED
R4 R5 = CMP-2002-07753-1: Manufacturer: Yageo / Phycomp; Part Number: RC0402FR-075K1L
R6 R7 = CMP-2002-07567-1: Manufacturer: Yageo / Phycomp; Part Number: RC0402FR-072K2L
R8 R9 = CMP-2002-00831-1: Manufacturer: Panasonic; Part Number: ERJ-2RKF27R4X
R10-R19 R21-R26 = CMP-2002-07353-1: Manufacturer: Yageo / Phycomp; Part Number: RC0402FR-0710KL
R20 R28 R29 R31 = CMP-2002-00622-4: RES SMD 10 OHM 1% 1/10W 0402; Manufacturer: Panasonic; Power Rating: 0.1W; Value: 10Ω; Automotive Grade: Grade 0; Octopart: https://octopart.com/erj-2rkf10r0x-panasonic-55404982; Digikey Description: RES SMD 10 OHM 1% 1/10W 0402; Mouser Description: Thick Film Resistors - SMD 0402 10.0ohms 1% Tol AEC-Q200; Series: ERJ; Temperature Range High: +155°C; ComponentLink2Description: Datasheet; Tolerance: 1%; Manufacturer Part Number: ERJ-2RKF10R0X; Temperature Range Low: -55°C; RoHS: TRUE; Footprint Url: https://industrial.panasonic.com/cdbs/www-data/pdf/RDA0000/DMA0000COL17.pdf; Lead Free: Yes
R27 R30 = CMP-26527-001998-1: Res Thick Film 2512 40mΩ 1% 2W ±200ppm/°C Molded SMD Plastic T/R; Resistance: 40mR; Packaging: Tape and Reel; Tolerance: 1%; Series: CSRN; Mount: Surface Mount; Width: 0.124inch; Number of Terminations: 2; Height: 0.028inch; Resistor Type: Thick Film; Temperature Coefficient: 200ppm/°C; RoHS Compliant: Yes; Length: 0.25inch; Case/Package: 2512; Min Operating Temperature: -55°C; Package Quantity: 4000; Max Operating Temperature: 155°C
R32 R35 = CMP-2002-08135-2: RES SMD 10K OHM 1% 1/16W 0402; Power Rating: 63mW; Resistance: 10kR; Case Code (Metric): 1005; Features: Automotive AEC-Q200; Termination: SMD/SMT; Mount: Surface Mount; Package Quantity: 10; Packaging: Tape and Reel; Case Code (Imperial): 0402; Weight: 2.3E-05oz; Lead Free: Lead Free; Width: 0.02inch; Max Power Dissipation: 63mW; Tolerance: 1%; Number of Terminations: 2; Height: 0.35mm
R33 = CMP-03412-015018-2: RES 86.6kΩ ±1% 0.063W 0402; Resistance: 86.6kR; Voltage Rating: 50V; Power Rating: 62.5mW; Max Power Dissipation: 63mW; Min Operating Temperature: -55°C; Weight: 2.3E-05oz; Case/Package: 0402; Max Operating Temperature: 155°C; Features: Moisture Resistant; RoHS Compliant: Yes; Number of Terminations: 2; Resistor Type: Thick Film; Case Code (Metric): 1005; Case Code (Imperial): 0402; Width: 0.5mm; Packaging: Tape and Reel
R36 R37 = CMP-08839-030882-1: Res Thick Film 0603 3kΩ 1% 0.1W ±100ppm/°C Automotive Paper T/R; Max Power Dissipation: 100mW; Resistance: 3kR; Case/Package: 0603; Number of Terminations: 2; RoHS Compliant: Yes; Case Code (Imperial): 0603; Height: 0.022inch; Length: 0.063inch; Package Quantity: 5000; Max Operating Temperature: 155°C; Resistor Type: Thick Film; Min Operating Temperature: -55°C; Tolerance: 1%; Width: 0.031inch; Packaging: Tape and Reel; Series: KTR; Case Code (Metric): 1608; Temperature Coefficient: 100ppm/°C; Features: Automotive AEC-Q200
SW1-SW10 = CMP-2100-03586-2: SWITCH TACTILE SPST-NO 0.05A 12V; Contact Resistance: 100mR; Operating Force: 1.5N; Max Current Rating: 50mA; Switch Travel: 0.15mm; Actuator Type: Standard; Height: 1.2mm; Width: 3mm; Weight: 0.000776oz; Contact Material: Silver; Max Voltage Rating (DC): 12V; Insulation Resistance: 100MR; Lead Free: Lead Free; Current Rating: 50mA; Termination: SMD/SMT; Length: 4mm; Voltage Rating (DC): 12V
U1 = W25Q128JVSIQ: No Description Available; Mfr_Name: Winbond; RefDes: RefDes; Type: Type
U2 U11 = CMP-04910-000017-1: IC CURRENT MONITOR 1% 10MSOP; Manufacturer: Texas Instruments; Number Of Outputs: 1; Min Supply Voltage: 3V; Standoff Height: 0.05mm; Ambient Temperature Range Low: -40°C; Device Class L3: unset; Manufacturer Part Number: INA220AIDGST; Temperature: -40°C to +125°C; Octopart: https://octopart.com/ina220aidgst-texas+instruments-10682915; Ambient Temperature Range High: +85°C; Mouser Description: Current & Power Monitors & Regulators Bi-Direct Current Power Monitor; Digikey Description: IC CURRENT MONITOR 1% 10MSOP; Lead Free: Yes; Height: 1.1mm; ComponentLink2Description: Datasheet; ComponentLink2URL: http://www.ti.com/lit/ds/symlink/ina220.pdf
U3 = CMP-1679-00010-1: Low-Dropout Positive Fixed Voltage Regulator, 1 A, 3.3 V Output Voltage, 0 to 125 degC, 4-Pin SOT-223 (318H-01), Pb-Free, Tape and Reel; Resistance: 220 kohm; Type (Resistor): Thick Film; Width: 0.85 mm; Weight: 7.1E-05 oz; ComponentLink2URL: http://www.onsemi.com/pub_link/Collateral/NCP1117-D.PDF; RoHSCompliant: true; Height: 0.45 mm; PackageDescription: 4-Pin Small Outline Transistor, Body 6.5 x 3.5 mm, Pitch 2.3 mm; ComponentLink1Description: Manufacturer URL; ComponentLink1URL: http://www.onsemi.com/; PackageReference: SOT-223-4-318H-01_A; Max Operating Temperature: 155 degC; Packaging: Tape and Reel; REACH SVHC: Unknown; Length: 1.55 mm; Package Quantity: 5000
U4 = SC091413: No Description Available; Mfr_Name: Raspberry Pi; Type: Embedded; RefDes: RefDes
U5 = CMP-0314-00021-2: Low-Voltage 8-Bit I2C and SMBus I/O Expander, 1.65 to 5.5 V, -40 to 85 degC, 16-pin UQFN (RSV), Green (RoHS & no Sb/Br); Manufacturer: Texas Instruments; Configuration Registers: Yes; Max Frequency(kHz): 400; # of I/Os: 8; SubFamily: I2C IO Expander; I2C Address: 0100 00x; VCC(Min)(V): 1.65; VCC(Max)(V): 5.5; Reset Input: Yes; ComponentLink2URL: http://www.ti.com/litv/pdf/mpqf115g; PackageVersion: revD, Dec-2011; No. of Outputs: 8; PackageReference: RSV0016A; DatasheetVersion: SCPS192C; fSCLK(Max)(MHz): 400; Mounting Technology: Surface Mount; ComponentLink1Description: Datasheet; Push-Pull I/O Type: Yes; Code_JEDEC: MO-288*; PackageDescription: 16-Leads Plastic Quad Flatpack No-Lead, 2.6 x 1.8 x 0.5 mm Body, 0.4 mm Pitch; ComponentLink1URL: http://www.ti.com/general/docs/lit/getliterature.tsp?genericPartNumber=TCA6408A&fileType=pdf; Interrupt Output: Yes; PartNumber: TCA6408ARSVR; Eco-Plan: Green (RoHS & no Sb/Br); Low Power: Yes; Vcc range(V): 1.65 to 5.5; ComponentLink2Description: Package Specification; 5V Tolerant I/O: Yes
U6 U10 U12 U13 = CMP-2000-04956-2: IC TRNSLTR BIDIRECTIONAL 20TSSOP; Number of Inputs: 8; Supply Current: 8uA; Low Level Output Current: 50mA; Min Supply Voltage: 1.2V; Quiescent Current: 3uA; Output Type: Voltage; Propagation Delay: 4.8ns; Max Supply Voltage: 5.5V; Number of Pins: 20; Packaging: Tape and Reel; Max Operating Temperature: 85°C; Height: 1.15mm; Nominal Supply Current: 8uA; Termination: SMD/SMT; Lead Free: Lead Free; Package Quantity: 1
U7 U8 = CMP-0188-00110-2: 8-Bit Single I2C Digital POT with Non-Volatile Memory, 8-pin MSOP, Extended Temperature; PackageReference: MSOP-MS8; PackageVersion: revBB, Aug-2009; ComponentLink3URL: http://www.microchip.com/stellent/groups/techpub_sg/documents/packagingspec/en012702.pdf; ComponentLink1Description: Manufacturer URL; ComponentLink2Description: Datasheet; ComponentLink3Description: Package Specification; DatasheetVersion: revA, Nov-2008; RevisionNote: URLs added.; ComponentLink1URL: http://www.microchip.com/; PackageDescription: 8-Lead Plastic Micro Small Outline Package (MS) [MSOP]; ComponentLink2URL: http://ww1.microchip.com/downloads/en/DeviceDoc/22107a.pdf
U9 = CMP-08072-000001-1: IC CLK GENERATOR 200MHZ 10MSOP; PLL: Yes; Number of Circuits: 2; Max Duty Cycle: 55%; Operating Supply Voltage: 3.3V; Input: Crystal; Number of Outputs: 3; Operating Supply Current: 22mA; Packaging: Tape and Reel; Max Frequency: 200MHz; Min Operating Temperature: -40°C; Case/Package: MSOP; Mount: Surface Mount; Max Operating Temperature: 85°C; RoHS Compliant: Yes; Series: MultiSynth™; Number of Pins: 10; Package Quantity: 2500
U14 = CMP-0069-01217-3: 520kHz/1.6MHz - Space-Efficient Boost and SEPIC DC-DC Regulator, 5-pin SOT-23, Pb-Free; Manufacturer: Texas Instruments; PackageTopMarking: SLEB*XTT; PowerWise: N; CompType: Switcher; ComponentLink1URL: http://www.ti.com/general/docs/lit/getliterature.tsp?genericPartNumber=LM2735&fileType=pdf; PackageReference: DBV0005A; PinCount: 5; RoHS: Y; PackageDescription: Molded SOT-23, .115 x .063 x .040 in Body, 5 Lead, .0375 in Pitch; ComponentLink1Description: Datasheet URL; Supplier 1: Mouser; Supplier Part Number 1: 926-LM2735XMF/NOPB
U15 U16 = CMP-04917-000172-1: IC REG LINEAR POS ADJ 1A 6WSON
X1 = ABM8-272-T3: No Description Available; Mfr_Name: Abracon; Type: Crystals; RefDes: RefDes
Y1 = FA-238_25.0000MB-K: MF: {'manufacturer': u'Epson'}; MP: FA-238 25.0000MB-K; Package: None; Price: None; Value: *; Availability: Unavailable
S1 = DS04-254-1L-06BK: Package: None; Value: *; Availability: Unavailable; Price: None; MP: DS04-254-1L-06BK